# EAGLE design Poly_Piezo (EAGLE 9.6.2)
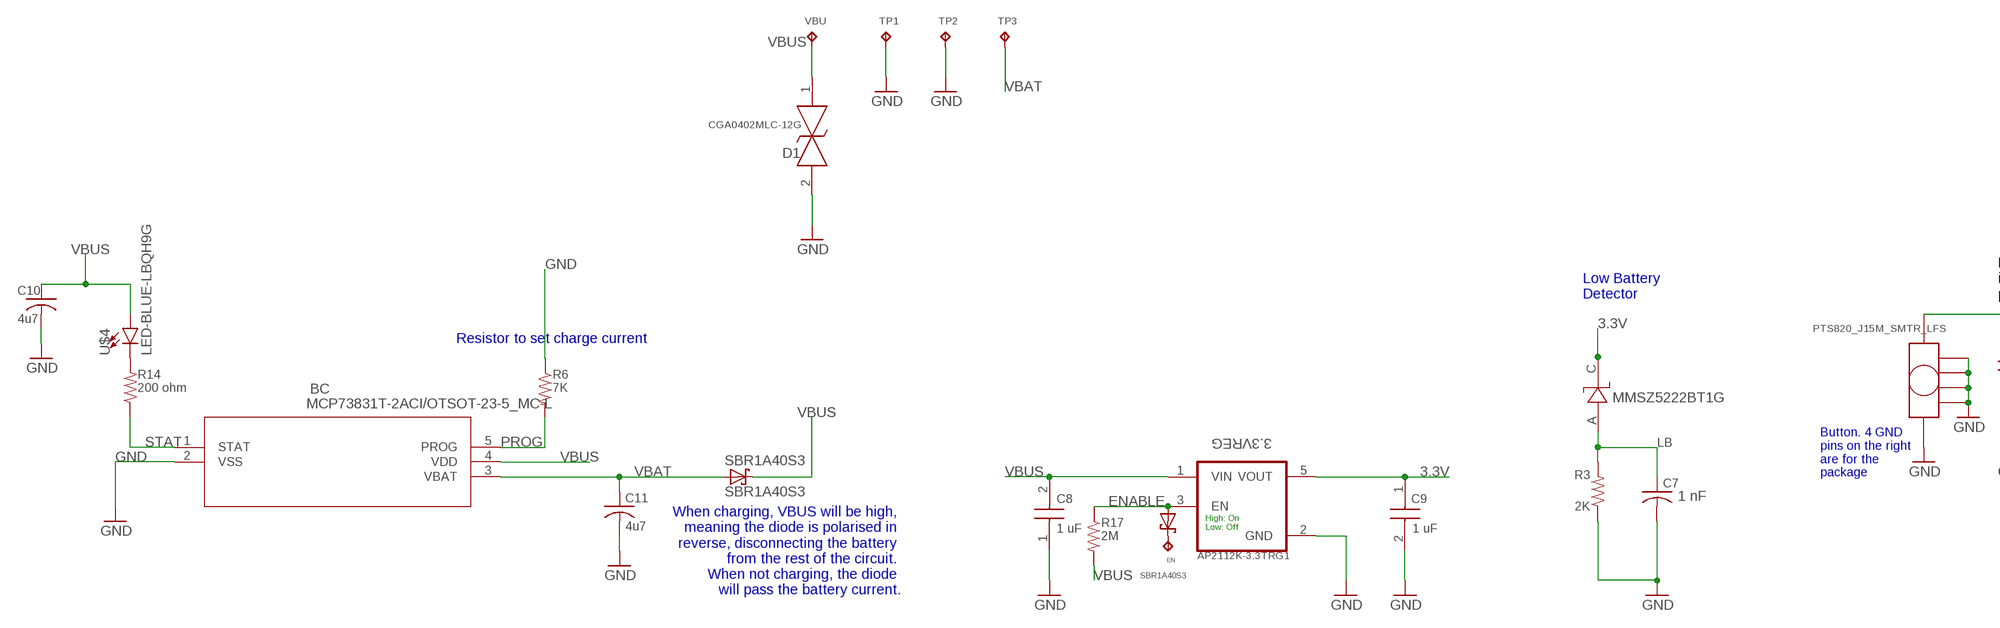
[diagram p0: schematic, sheet 1, part 1 of 2]
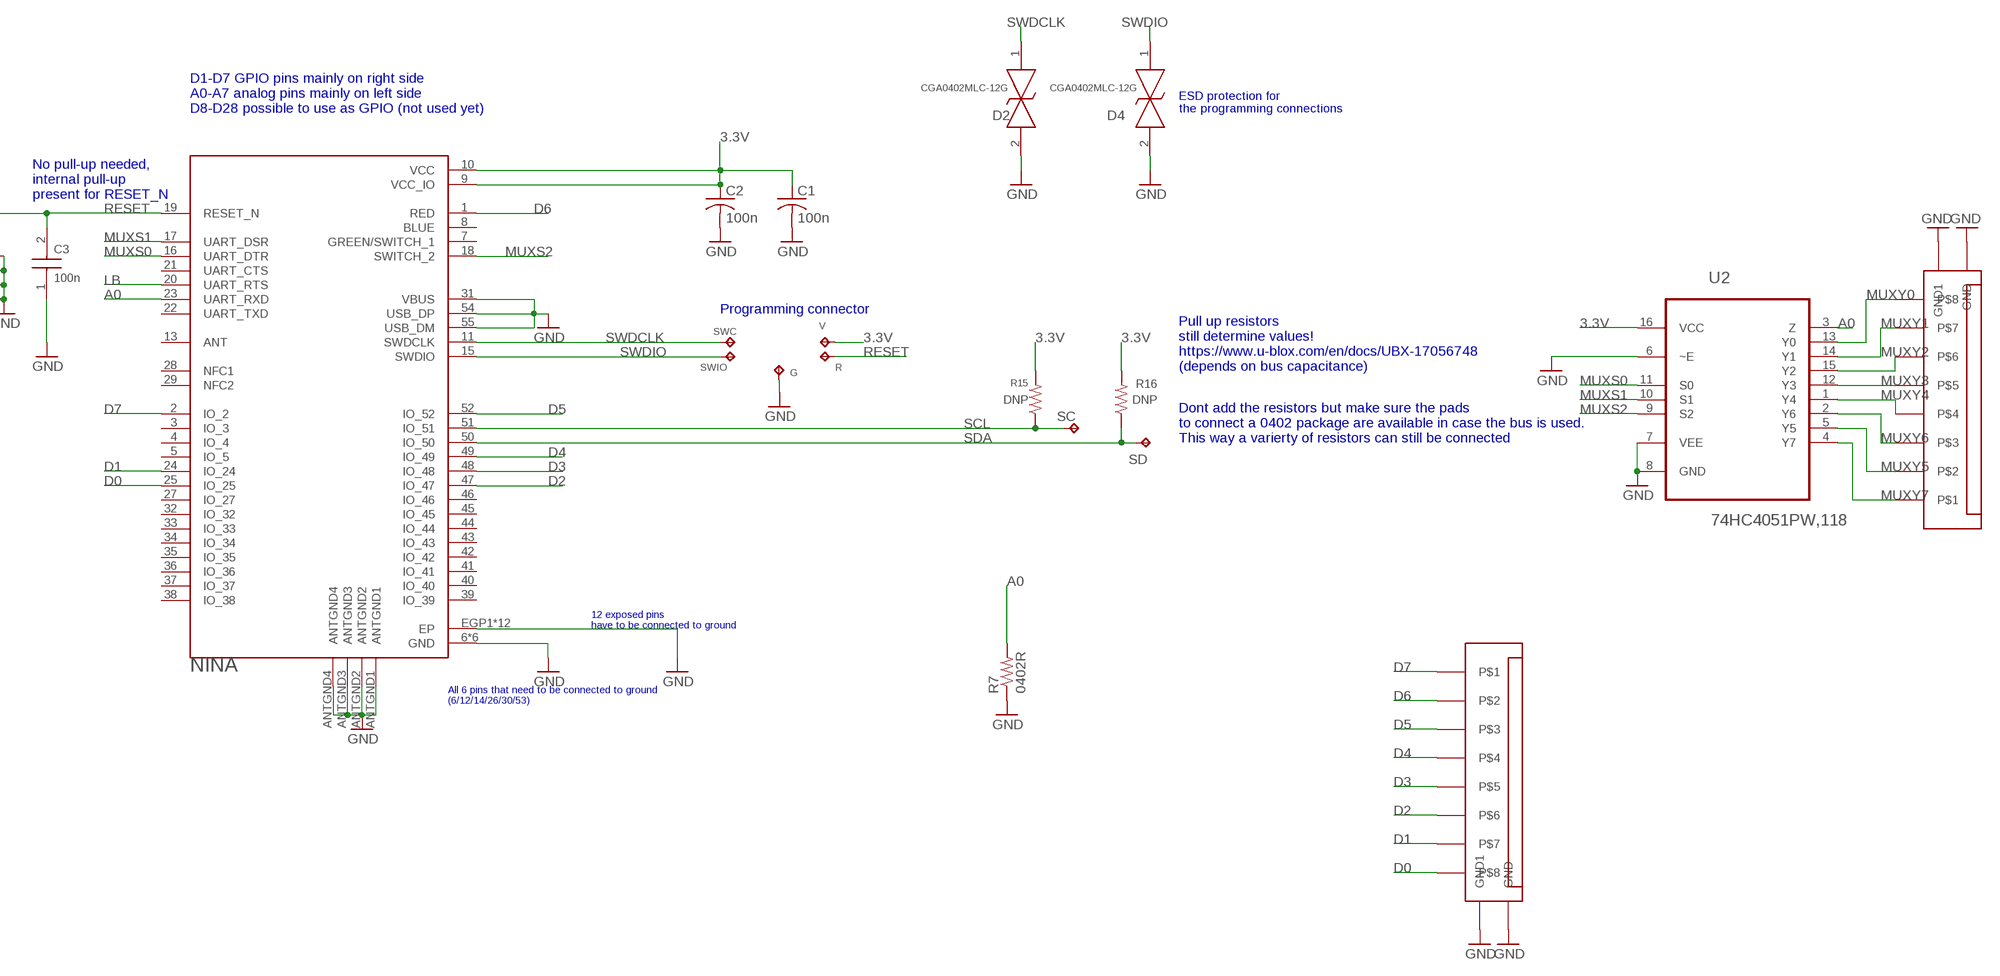
[diagram p1: schematic, sheet 1, part 2 of 2]

## Parts
3.3VREG  AP2112K-3.3TRG1  [SOT95P285X140-5N]
BC  MCP73831T-2ACI/OTSOT-23-5_MC-L  [SOT-23-5_MC-L]
BUTTON  PTS820_J15M_SMTR_LFS  [PTS820_J15]
C1  100n  C-USC0402  [C0402]
C2  100n  C-USC0402  [C0402]
C3  100n  JMK105BJ105KP-F  [CAPC1005X33N]
C7  1 nF  C-USC0402  [C0402]
C8  1 uF  JMK105BJ105KP-F  [CAPC1005X33N]
C9  1 uF  JMK105BJ105KP-F  [CAPC1005X33N]
C10  4u7  C-USC0402  [C0402]
C11  4u7  C-USC0402  [C0402]
D1  CGA0402MLC-12G  [CGA0402MLC12G]
D2  CGA0402MLC-12G  [CGA0402MLC12G]
D4  CGA0402MLC-12G  [CGA0402MLC12G]
EN  CUSTOM_HOLE1  [CUSTOM_HOLE]
G  TPB1,27  [B1,27]
MMSZ5222BT1G  MMSZ5222BT1G  [SOD−123]
R  TPB1,27  [B1,27]
R3  2K  0402R  [RESC1005X40N]
R6  7K  0402R  [RESC1005X40N]
R7  0402R  [RESC1005X40N]
R14  200 ohm  0402R  [RESC1005X40N]
R15  DNP  0402R  [RESC1005X40N]
R16  DNP  0402R  [RESC1005X40N]
R17  2M  0402R  [RESC1005X40N]
SBR1A40S3  SBR1A40S3  [SOD323]
SC  CUSTOM_HOLE1  [CUSTOM_HOLE]
SD  CUSTOM_HOLE1  [CUSTOM_HOLE]
SWC  TPB1,27  [B1,27]
SWIO  TPB1,27  [B1,27]
TP1  CUSTOM_HOLE1  [CUSTOM_HOLE]
TP2  CUSTOM_HOLE1  [CUSTOM_HOLE]
TP3  CUSTOM_HOLE1  [CUSTOM_HOLE]
U1  NINA  NINA-B306  [XCVR_NINA-B306]
U2  74HC4051PW,118  [SOP65P640X110-16N]
U$1  XF3M(1)-0815-1B  [XF3M(1)-0815-1B]
U$2  SBR1A40S3  [SOD323]
U$3  XF3M(1)-0815-1B  [XF3M(1)-0815-1B]
U$4  LED-BLUE-LBQH9G  [LBQH9G-0402]
V  TPB1,27  [B1,27]
VBU  CUSTOM_HOLE1  [CUSTOM_HOLE]

## Nets
3.3V: 3.3VREG.5(VOUT) C1.1 C2.1 C9.1 MMSZ5222BT1G.C R15.2 R16.2 U1.9(VCC_IO) U1.10(VCC) U2.16(VCC) V.TP
A0: R7.2 U1.23(UART_RXD) U2.3(Z)
D0: U1.25(IO_25) U$1.P$8
D1: U1.24(IO_24) U$1.P$7
D2: U1.47(IO_47) U$1.P$6
D3: U1.48(IO_48) U$1.P$5
D4: U1.49(IO_49) U$1.P$4
D5: U1.52(IO_52) U$1.P$3
D6: U1.1(RED) U$1.P$2
D7: U1.2(IO_2) U$1.P$1
ENABLE: 3.3VREG.3(EN) R17.1 U$2.A
GND: 3.3VREG.2(GND) BC.2(VSS) BUTTON.1 BUTTON.P$1 BUTTON.P$2 BUTTON.P$3 BUTTON.P$4 C1.2 C2.2 C3.1 C7.2 C8.1 C9.2 C10.2 C11.2 D1.2 D2.2 D4.2 G.TP R3.1 R6.1 R7.1 TP1.P$1(TP) TP2.P$1(TP) U1.6(GND) U1.12(GND) U1.14(GND) U1.26(GND) U1.30(GND) U1.31(VBUS) U1.53(GND) U1.54(USB_DP) U1.55(USB_DM) U1.ANTGND1 U1.ANTGND2 U1.ANTGND3 U1.ANTGND4 U1.EGP1(EP) U1.EGP2(EP) U1.EGP3(EP) U1.EGP4(EP) U1.EGP5(EP) U1.EGP6(EP) U1.EGP7(EP) U1.EGP8(EP) U1.EGP9(EP) U1.EGP10(EP) U1.EGP11(EP) U1.EGP12(EP) U2.6(~E) U2.7(VEE) U2.8(GND) U$1.P$9(GND1) U$1.P$10(GND) U$3.P$9(GND1) U$3.P$10(GND)
LB: C7.1 MMSZ5222BT1G.A R3.2 U1.20(UART_RTS)
MUXS0: U1.16(UART_DTR) U2.11(S0)
MUXS1: U1.17(UART_DSR) U2.10(S1)
MUXS2: U1.18(SWITCH_2) U2.9(S2)
MUXY0: U2.13(Y0) U$3.P$8
MUXY1: U2.14(Y1) U$3.P$7
MUXY2: U2.15(Y2) U$3.P$6
MUXY3: U2.12(Y3) U$3.P$5
MUXY4: U2.1(Y4) U$3.P$4
MUXY5: U2.5(Y5) U$3.P$2
MUXY6: U2.2(Y6) U$3.P$3
MUXY7: U2.4(Y7) U$3.P$1
N$1: R14.2 U$4.C
N$11: EN.P$1(TP) U$2.C
PROG: BC.5(PROG) R6.2
RESET: BUTTON.2 C3.2 R.TP U1.19(RESET_N)
SCL: R15.1 SC.P$1(TP) U1.51(IO_51)
SDA: R16.1 SD.P$1(TP) U1.50(IO_50)
STAT: BC.1(STAT) R14.1
SWDCLK: D2.1 SWC.TP U1.11(SWDCLK)
SWDIO: D4.1 SWIO.TP U1.15(SWDIO)
VBAT: BC.3(VBAT) C11.1 SBR1A40S3.A TP3.P$1(TP)
VBUS: 3.3VREG.1(VIN) BC.4(VDD) C8.2 C10.1 D1.1 R17.2 SBR1A40S3.C U$4.A VBU.P$1(TP)
Unconnected: U1.3(IO_3) U1.4(IO_4) U1.5(IO_5) U1.7(GREEN/SWITCH_1) U1.8(BLUE) U1.13(ANT) U1.21(UART_CTS) U1.22(UART_TXD) U1.27(IO_27) U1.28(NFC1) U1.29(NFC2) U1.32(IO_32) U1.33(IO_33) U1.34(IO_34) U1.35(IO_35) U1.36(IO_36) U1.37(IO_37) U1.38(IO_38) U1.39(IO_39) U1.40(IO_40) U1.41(IO_41) U1.42(IO_42) U1.43(IO_43) U1.44(IO_44) U1.45(IO_45) U1.46(IO_46)

## Notes on the sheet
- D1-D7 GPIO pins mainly on right side
  A0-A7 analog pins mainly on left side
  D8-D28 possible to use as GPIO (not used yet)
- ESD protection for 
  the programming connections
- Low Battery
  Detector
- No pull-up needed,
  internal pull-up
  present for RESET_N
- Resistor to set charge current
- Programming connector
- Button. 4 GND
  pins on the right
  are for the
  package
- Pull up resistors
  still determine values!
  https://www.u-blox.com/en/docs/UBX-17056748
  (depends on bus capacitance)
- When charging, VBUS will be high, 
  meaning the diode is polarised in 
  reverse, disconnecting the battery 
  from the rest of the circuit. 
  When not charging, the diode 
  will pass the battery current.
- High: On
  Low: Off
- Dont add the resistors but make sure the pads 
  to connect a 0402 package are available in case the bus is used. 
  This way a varierty of resistors can still be connected
- 12 exposed pins 
  have to be connected to ground
- All 6 pins that need to be connected to ground
  (6/12/14/26/30/53)

## Library data of the parts
3.3VREG = AP2112K-3.3TRG1:AP2112K-3.3TRG1: AP2112 Series 0.6 A 3.3 V Fixed Output SMT LDO Linear Regulator - SOT23-5; AVAILABILITY: Unavailable; DESCRIPTION: Linear Voltage Regulator IC 1 Output 600mA SOT-25; MF: Diodes Inc.; MP: AP2112K-3.3TRG1; PACKAGE: SOT-753 Diodes Inc.; PRICE: None
BC = MCP73831T-2ACI-OT_BattCharg:MCP73831T-2ACI/OT; BUILT_BY: EMA_UL_Team; MANUFACTURER_PART_NUMBER: MCP73831T-2ACI/OT; VENDOR: Microchip
BUTTON = [button]PTS820_J15M_SMTR_LFS:PTS820_J15M_SMTR_LFS: PTS 820 Series Microminiature SMT Top Actuated Source: Datasheet <http://www.ckswitches.com/media/1474/pts820.pdf>; DESCRIPTION: PTS 820 Series Microminiature SMT Top Actuated; HEIGHT: mm; MANUFACTURER_NAME: C & K COMPONENTS; MANUFACTURER_PART_NUMBER: PTS820 J15M SMTR LFS; MOUSER_PART_NUMBER: 611-PTS820J15MSMTR; MOUSER_PRICE-STOCK: https://www.mouser.com/Search/Refine.aspx?Keyword=611-PTS820J15MSMTR; RS_PART_NUMBER: 1359503P; RS_PRICE-STOCK: http://uk.rs-online.com/web/p/products/1359503P
C1 C2 C7 C10 C11 = rcl:C-US: CAPACITOR, American symbol; SPICEPREFIX: C
C3 C8 C9 = capacitor_1uF_0402:JMK105BJ105KP-F: Taiyo Yuden JMK105BJ105KP-F 1F MLCC 6.3V dc +/-10% Tolerance SMD Source: Datasheet <https://componentsearchengine.com/Datasheets/1/JMK105BJ105KP-F.pdf>; DESCRIPTION: Taiyo Yuden JMK105BJ105KP-F 1F MLCC 6.3V dc +/-10% Tolerance SMD; HEIGHT: 0.33mm; MANUFACTURER_NAME: TAIYO YUDEN; MANUFACTURER_PART_NUMBER: JMK105BJ105KP-F; MOUSER_PART_NUMBER: 963-JMK105BJ105KP-F; MOUSER_PRICE-STOCK: https://www.mouser.com/Search/Refine.aspx?Keyword=963-JMK105BJ105KP-F
D1 D2 D4 = CGA0402MLC-12G:CGA0402MLC-12G: Bourns CGA0402MLC-12G, ESD Protection Diode, 2-Pin MLC Source: Datasheet <https://componentsearchengine.com/Datasheets/1/CGA0402MLC-12G.pdf>; DESCRIPTION: Bourns CGA0402MLC-12G, ESD Protection Diode, 2-Pin MLC; HEIGHT: 0.44mm; MANUFACTURER_NAME: Bourns; MANUFACTURER_PART_NUMBER: CGA0402MLC-12G; MOUSER_PART_NUMBER: 652-CGA0402MLC-12G; MOUSER_PRICE-STOCK: https://www.mouser.com/Search/Refine.aspx?Keyword=652-CGA0402MLC-12G
EN SC SD TP1-TP3 VBU = testpad:CUSTOM_HOLE1
G R SWC SWIO V = testpad:TP: Test pad
MMSZ5222BT1G = [Zener]MMSZ52xxxT1G:MMSZ5222BT1G
R3 R6 R7 R14-R17 = custom0402R:0402R
SBR1A40S3 U$2 = diode:SBR1A40S3
U1 = NINA-B306:NINA-B306: BLUETOOTH LOW ENERGY MODULE STAN; AVAILABILITY: Unavailable; DESCRIPTION: Bluetooth Bluetooth v5.0 Transceiver Module 2.4GHz Antenna Not Included Surface Mount; MF: U-Blox America Inc.; MP: NINA-B311-00B; PACKAGE: SMD-55 U-Blox America Inc.; PRICE: None
U2 = 74HC4051PW_118:74HC4051PW,118: 8-channel analog multiplexer/demultiplexer Check availability <https://pricing.snapeda.com/parts/74HC4051PW%2C118/Nexperia%20USA%20Inc./view-part?ref=eda>; AVAILABILITY: In Stock; DESCRIPTION: 1 Circuit IC Switch 8:1 120Ohm 16-TSSOP; MF: Nexperia USA Inc.; MP: 74HC4051PW,118; PACKAGE: TSSOP-16 Texas Instruments; PRICE: None; PURCHASE-URL: https://pricing.snapeda.com/search/part/74HC4051PW,118/?ref=eda
U$1 U$3 = XF3M(1)-0815-1B:XF3M(1)-0815-1B
U$4 = SparkFun-LED:LED-BLUE-LBQH9G

## Board
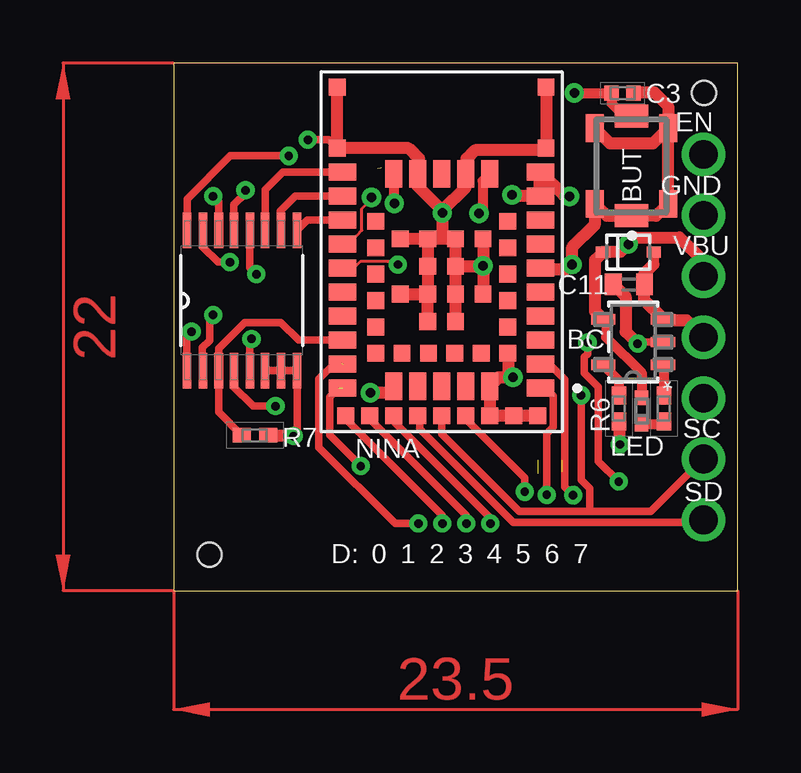
[diagram p2: board, top side]
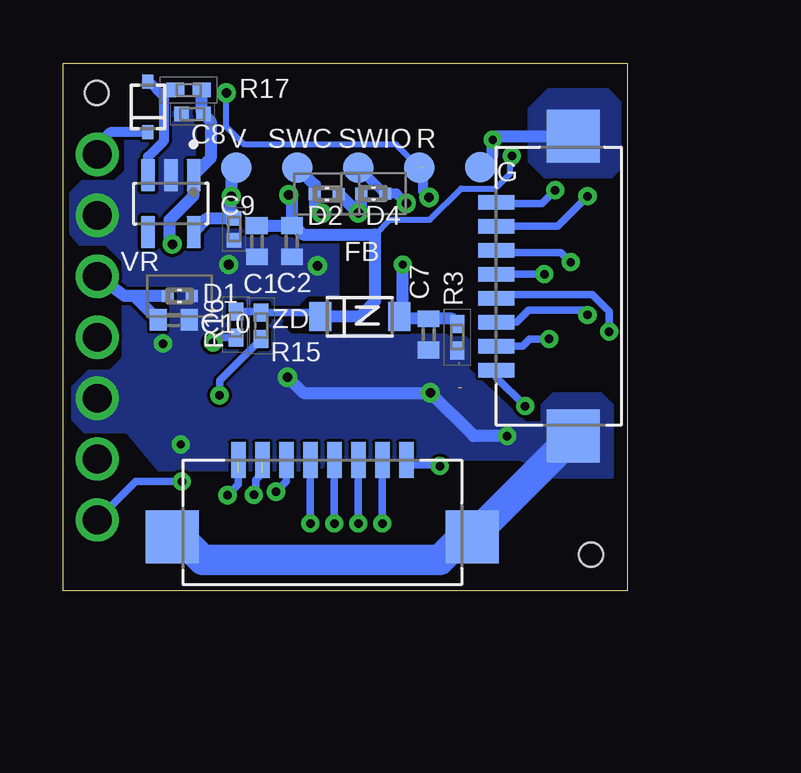
[diagram p3: board, bottom side, seen from below]

Size 23.5 x 22 mm. Coordinates in mm from the lower left corner, seen from the top.
Outline: 0,0 23.5,0 23.5,22 0,22 0,0
Copper layers (1*16): Top 0.035mm / dielectric 1.5mm / Bottom 0.035mm
Design rules "default *": minimum track width 3mil, minimum drill 0.35mm, track to track 5mil, track to pad 5mil, pad to pad 6mil, via to via 6mil, smd to smd 6mil, copper to edge 10mil, drill to drill 0.4mm, minimum pad ring 10mil, minimum via ring 8mil, stop-mask expansion 4mil, vias tented up to drill 0mil, thermal gap 0mil
Holes 1 mm at 22.1,20.75 1.5,1.5

### Footprints (pad centres in the part's own frame; a part is rotated, then mirrored left to right if it is on the bottom)
SOT95P285X140-5N = smd 1.35 x 0.6: 1 -1.185,0.95; 2 -1.185,0; 3 -1.185,-0.95; 4 1.185,-0.95; 5 1.185,0.95
SOT-23-5_MC-L = smd 1.01 x 0.428: 1 -1.245,0.95; 2 -1.245,0; 3 -1.245,-0.95; 4 1.245,-0.95; 5 1.245,0.95
PTS820_J15 = smd 0.95 x 1.4: 1 -2.075,0; 2 2.075,0 | smd 1.15 x 0.75: P$1 -1.575,1.525; P$2 1.575,1.525; P$3 1.575,-1.525; P$4 -1.575,-1.525
C0402 = smd 0.7 x 0.9: 1 -0.65,0; 2 0.65,0
CAPC1005X33N = smd 0.6 x 0.62: 1 -0.46,0; 2 0.46,0
CGA0402MLC12G = smd 0.5 x 0.5: 1 -0.5,0; 2 0.5,0
CUSTOM_HOLE = drill 1.2: P$1 0,0
B1,27 = smd 1.27 x 1.27: TP 0,0
SOD−123 = smd 0.91 x 1.22: A 3.28,0; C 0,0
RESC1005X40N = smd 0.75 x 0.6: 1 -0.55,0; 2 0.55,0
SOD323 = smd 0.59 x 0.45: A 2.405,0; C 0.295,0
XCVR_NINA-B306 = smd 1.15 x 0.7: 1 -4.125,4; 2 -4.125,3; 3 -4.125,2; 4 -4.125,1; 5 -4.125,0; 6 -4.125,-1; 7 -4.125,-2; 8 -4.125,-3; 9 -4.125,-4; 10 -4.125,-5; 16 4.125,-5; 17 4.125,-4; 18 4.125,-3; 19 4.125,-2; 20 4.125,-1; 21 4.125,0; 22 4.125,1; 23 4.125,2; 24 4.125,3; 25 4.125,4 | smd 0.7 x 1.15: 11 -2,-4.925; 12 -1,-4.925; 13 0,-4.925; 14 1,-4.925; 15 2,-4.925; 26 2,3.925; 27 1,3.925; 28 0,3.925; 29 -1,3.925; 30 -2,3.925 | smd 0.7 x 0.7: 31 -2.75,2.55; 32 -2.75,1.45; 33 -2.75,0.35; 34 -2.75,-0.75; 35 -2.75,-1.85; 36 -2.75,-2.95; 37 2.75,-2.95; 38 2.75,-1.85; 39 2.75,-0.75; 40 2.75,0.35; 41 2.75,1.45; 42 2.75,2.55; 43 1.65,2.55; 44 0.55,2.55; 45 -0.55,2.55; 46 -1.65,2.55; 47 4,5.15; 48 3,5.15; 49 2,5.15; 50 1,5.15; 51 0,5.15; 52 -1,5.15; 53 -2,5.15; 54 -3,5.15; 55 -4,5.15; ANTGND1 -4.35,-6; ANTGND2 -4.35,-8.55; ANTGND3 4.35,-6; ANTGND4 4.35,-8.55; EGP1 -0.575,1.225; EGP2 0.575,1.225; EGP3 -1.725,0.075; EGP4 -0.575,0.075; EGP5 0.575,0.075; EGP6 1.725,0.075; EGP7 -0.575,-1.075; EGP8 0.575,-1.075; EGP9 -1.725,-2.225; EGP10 -0.575,-2.225; EGP11 0.575,-2.225; EGP12 1.725,-2.225
SOP65P640X110-16N = smd 1.473 x 0.356: 1 -2.921,2.286; 2 -2.921,1.626; 3 -2.921,0.965; 4 -2.921,0.33; 5 -2.921,-0.33; 6 -2.921,-0.965; 7 -2.921,-1.626; 8 -2.921,-2.286; 9 2.921,-2.286; 10 2.921,-1.626; 11 2.921,-0.965; 12 2.921,-0.33; 13 2.921,0.33; 14 2.921,0.965; 15 2.921,1.626; 16 2.921,2.286
XF3M(1)-0815-1B = smd 0.6 x 1.5: P$1 -3.5,0; P$2 -2.5,0; P$3 -1.5,0; P$4 -0.5,0; P$5 0.5,0; P$6 1.5,0; P$7 2.5,0; P$8 3.5,0 | smd 2.2 x 2.2: P$9 -6.25,-3.2; P$10 6.25,-3.2
LBQH9G-0402 = smd 0.6 x 0.55: A 0.55,0; C -0.55,0

### Placement (x,y rotation side)
3.3VREG  19.01,16.14 270 bottom
BC  19.15,10.37 180 top
BUTTON  19.08,17.71 90 top
C1  15.42,14.57 270 bottom
C2  13.97,14.57 270 bottom
C3  18.71,20.75 180 top
C7  8.27,10.69 270 bottom
C8  18.11,19.88 0 bottom
C9  16.38,15.07 270 bottom
C10  18.89,11.29 0 bottom
C11  18.97,12.77 180 top
D1  18.65,12.29 0 bottom
D2  12.51,16.54 0 bottom
D4  10.57,16.56 180 bottom
EN  22.08,18.19 90 top
G  6.11,17.66 0 bottom
MMSZ5222BT1G  12.78,11.43 0 bottom
R  8.66,17.65 0 bottom
R3  7.08,10.57 90 bottom
R6  18.56,7.6 90 top
R7  3.39,6.48 180 top
R14  20.43,7.6 270 top
R15  15.25,11.05 90 bottom
R16  16.3,11.1 90 bottom
R17  18.27,20.88 0 bottom
SBR1A40S3  17.6,14.12 0 top
SC  22.08,5.49 270 top
SD  22.08,2.95 270 top
SWC  13.74,17.65 0 bottom
SWIO  11.2,17.65 0 bottom
TP1  22.08,15.65 0 bottom
TP2  22.08,8.03 0 top
TP3  22.08,10.57 0 top
U1  11.17,12.45 180 top
U2  2.85,12.1 90 top
U$1  12.7,5.45 0 bottom
U$2  19.97,18.82 90 bottom
U$3  5.45,12.7 90 bottom
U$4  19.5,7.5 90 top
V  16.29,17.65 0 bottom
VBU  22.08,13.11 180 top

### Tracks (layer width: path | path; a pad name or v marks a point on that pad's centre or on a via)
3.3V  (via drill 0.35, 0.4)
  Top 0.305: U2.16 0.57,16.33 2.37,18.13 v4.8,18.13
  Top 0.508: v16.5,16.45 16.3,16.45 15.35,17.39 15.39,17.39 15.45,17.45 U1.10 | U1.9 14.15,16.45 v14.1,16.5
  Top 0.61: U1.10 U1.9
  Bottom 0.254: 10.5,14.86 9.89,15.47 8.22,15.47 6.91,16.77 5.49,16.77 4.87,17.39 4.87,18.06 v4.8,18.13
  Bottom 0.305: R16.2 15.3,11.65 R15.2 12.95,11.6 MMSZ5222BT1G.C
  Bottom 0.508: C1.1 C2.1 | 3.3VREG.5 17.48,15.53 C9.1 16.53,15.68 16.53,16.41 v16.5,16.45 16.5,17.45 V.TP | v14.1,16.5 13.97,16.37 C2.1 | C2.1 13.87,15.22 13.51,14.86 10.5,14.86 10.5,13.5 10.5,12.07 11.14,11.43 MMSZ5222BT1G.C
A0
  Top 0.305: U1.23 5.21,10.45 4.48,11.18 2.97,11.18 1.89,10.1 U2.3 1.89,7.45 R7.2
D0  (via drill 0.35)  (1 unrouted)
  Top 0.305: 6.89,8.45 6.51,8.08 6.51,6.49 v7.8,5.2
  Bottom 0.305: v7.8,5.2 7.85,5.25 9,5.25 U$1.P$8
D1  (via drill 0.35)  (1 unrouted)
  Top 0.305: 6.99,9.51 6.74,9.51 6.06,8.82 6.06,5.98 9.23,2.8 v10.2,2.8
  Bottom 0.305: v10.2,2.8 U$1.P$7
D2  (via drill 0.35)
  Top 0.152: U1.47 7.2,7.27
  Top 0.305: 7.2,7.27 7.13,7.2 11.2,3.14 v11.2,2.8
  Bottom 0.305: U$1.P$6 v11.2,2.8
D3  (via drill 0.35)
  Top 0.305: U1.48 8.16,7.17 12.2,3.14 v12.2,2.8
  Bottom 0.305: U$1.P$5 v12.2,2.8
D4  (via drill 0.35)
  Top 0.305: U1.49 9.05,7.18 13.2,3.04 v13.2,2.8
  Bottom 0.305: U$1.P$4 v13.2,2.8
D5  (via drill 0.35)
  Top 0.305: U1.52 12.21,7.25 12.21,7.12 14.63,4.71 v14.63,4.13
  Bottom 0.305: v14.63,4.13 14.2,4.57 U$1.P$3
D6  (via drill 0.35)  (1 unrouted)
  Top 0.305: v15.55,4 15.55,6.55 15.82,6.82 15.82,8.12 15.49,8.45 U1.1
  Bottom 0.305: v15.55,4 15.47,4.08 15.47,4.62 15.2,4.88
D7  (via drill 0.35)  (1 unrouted)
  Top 0.305: U1.2 15.34,9.4 15.7,9.4 16.3,8.8 16.3,4.33 v16.65,3.98
  Bottom 0.305: v16.65,3.98 16.2,4.43 16.2,4.95
ENABLE
  Bottom 0.406: 3.3VREG.3 19.96,18.1 19.29,18.77 19.29,20.74 | U$2.A 19.92,21.23 19.36,20.67 19.29,20.74 | R17.1 19.15,20.88 19.29,20.74
GND  (via drill 0.35, 0.4)
  Top 0.15: U1.31
  Top 0.152: U1.EGP1 11.71,11.26 | U1.EGP5 10.6,12.35 10.57,12.38 | v12.89,13.54 v12.9,13.55 | U1.EGP7 11.77,13.54 | U1.26 8.89,8.25
  Top 0.254: 13.97,9.86 U1.31
  Top 0.305: U2.6 U2.7 U2.8 5.15,9.16 5.15,6.6 v5,6.45 | U1.ANTGND3 6.47,18.8 v5.6,18.8 | BC.2 19.41,10.37 v19.34,10.3
  Top 0.508: U1.EGP11 U1.EGP8 U1.EGP5 | U1.55 U1.54 U1.53 U1.30 13.54,8.9 v14.15,8.9 13.97,9.08 13.97,9.86 | U1.EGP1 U1.EGP4 U1.EGP7 U1.EGP10 11.2,14.68 | U1.EGP2 10.6,12.35 | 11.77,13.54 v12.89,13.54 | U1.EGP9 v12.9,13.55 U1.EGP3 | U1.ANTGND2 U1.ANTGND1 15.43,18.36 12.55,18.36 12.21,18.02 12.21,17.42 U1.12 12.17,16.82 11.2,15.85 | U1.EGP12 U1.EGP11 | U1.EGP6 10.57,12.38 | U1.ANTGND4 U1.ANTGND3 9.79,18.45 10.23,18.02 10.23,17.43 U1.14 10.17,16.88 10.21,16.83 11.2,15.85 | 8.89,8.25 v8.2,8.25 | U1.6 15.35,13.39 16.34,13.39 16.55,13.6 v16.6,13.6 16.6,14.3 17.54,15.24 17.54,16.12 BUTTON.P$1 18.05,15.63 BUTTON.1 20.11,15.63 BUTTON.P$4 BUTTON.P$3 | U1.EGP11 11.2,14.68 | 11.2,15.85 v11.2,15.75 11.2,14.68 | C11.2 18.34,12.77 18.84,12.28 18.84,10.8 v19.34,10.3 | BUTTON.P$2 18.19,18.65 19.97,18.65 BUTTON.P$3 | v18.6,6.1 18.6,7.05 R6.1 | C3.1 19.19,20.77 20.05,20.77 20.61,20.21 BUTTON.P$3 | R7.1 4.97,6.48 v5,6.45
  Bottom 0.508: v14.15,8.9 13.5,8.25 v8.2,8.25 6.4,6.45 v5,6.45 | D4.2 11.07,15.88 v11.2,15.75 11.99,16.54 D2.2 | U$3.P$10 5.45,18.95 v5.6,18.8 5.6,18.17 G.TP
  Bottom 1.27: U$3.P$9 U$1.P$10 6.85,2.25 7.82,1.28 17.68,1.28 18.65,2.25 U$1.P$9
  pour Bottom: 18.06,17.21 16,15.15 12.05,15.15 12.05,12.35 13.3,12.35 14.5,11.15 14,10.65 6.85,10.65 6.65,10.45 6.65,9.25 4.25,7 2.95,7 2.8,6.85 2.8,6.05 3.7,5.15 3.85,5.15 4,5.3 4.5,5.5 12.35,5.5 12.8,5.05 19.54,5.05 20.84,6.65 22.62,6.65 23.1,7.13 23.1,8.5 22.45,9.15 21.55,9.15 21,9.7 21,13.75 21.7,14.45 22.8,14.45 23.3,15.05 23.3,16.45 22.7,17.05 21.35,17.05 20.9,17.5 20.9,20.05 17.99,20.05
  pour Bottom: 0.7,17.35 3.4,17.35 4,17.95 4,20.05 3.25,20.8 0.85,20.8 0.3,20.25 0.3,17.75
  pour Bottom: 0.6,4.8 0.6,7.75 1.05,8.2 3.1,8.2 3.55,7.75 3.55,5.25 3.1,4.8 3.05,4.75 0.6,4.75
LB  (via drill 0.35)
  Top 0.127: U1.20 7.5,13.45 7.79,13.74 9.2,13.74 v9.34,13.6 v9.35,13.6
  Bottom 0.127: 9.38,11.22 9.5,11.35 | 9.35,11.58 9.41,11.52 MMSZ5222BT1G.A 9.62,11.31
  Bottom 0.152: 9.5,11.35 MMSZ5222BT1G.A
  Bottom 0.508: MMSZ5222BT1G.A 9.35,11.58 v9.35,13.6 | R3.2 7.3,11.34 C7.1 9.26,11.34 9.38,11.22
MUXS0
  Top 0.305: U2.11 3.81,16.72 4.54,17.45 U1.16
MUXS1
  Top 0.305: U2.10 4.45,15.04 4.45,15.83 5.07,16.45 U1.17
MUXS2
  Top 0.305: U1.18 5.57,15.45 U2.9
MUXY0  (via drill 0.35)
  Top 0.305: v3,16.7 3,16.59 2.52,16.11 U2.13
  Bottom 0.305: v3,16.7 3.55,16.15 5.4,16.15 U$3.P$8
MUXY1  (via drill 0.35)
  Top 0.305: U2.14 1.89,16.21 v1.65,16.45
  Bottom 0.305: v1.65,16.45 2.9,15.2 U$3.P$7
MUXY2  (via drill 0.35)
  Top 0.305: U2.15 1.2,15 1.2,14.36 1.86,13.7 v2.35,13.7
  Bottom 0.305: v2.35,13.7 2.37,13.7 2.77,14.11 5.36,14.11 U$3.P$6
MUXY3  (via drill 0.35)
  Top 0.305: U2.12 3.18,13.47 v3.45,13.2
  Bottom 0.305: v3.45,13.2 U$3.P$5
MUXY4  (via drill 0.35)
  Top 0.305: U2.1 0.54,9.2 0.54,9.84 0.55,9.85 0.55,10.6 v0.75,10.8
  Bottom 0.305: v0.75,10.8 0.75,11.65 1.45,12.35 5.3,12.35 U$3.P$4
MUXY5  (via drill 0.35)
  Top 0.305: U2.5 3.18,10.43 v3.25,10.5
  Bottom 0.305: U$3.P$2 4.35,10.2 4.05,10.5 v3.25,10.5
MUXY6  (via drill 0.35)
  Top 0.305: U2.2 1.2,9.2 1.2,10.14 1.5,10.44 1.5,11.35 v1.65,11.5
  Bottom 0.305: v1.65,11.5 1.85,11.7 4.1,11.7 4.6,11.2 U$3.P$3
MUXY7  (via drill 0.35)
  Top 0.305: U2.4 2.5,9.16 2.5,8.52 3.31,7.7 v4.25,7.7
  Bottom 0.305: v4.25,7.7 5.45,8.9 U$3.P$1
N$1
  Top 0.406: U$4.C 20.48,6.95 20.43,7 R14.2
N$11
  Bottom 0.406: U$2.C 21.55,19.11 22,18.67 EN.P$1
PROG
  Top 0.406: BC.5 18.56,8.77 R6.2
RESET  (via drill 0.4)  (1 unrouted)
  Top 0.127: U1.19 7.08,14.48 7.33,14.48 7.84,15.03 7.84,15.94 8.25,16.33 v8.25,16.4
  Top 0.406: v16.7,20.75 C3.2 18.25,20.32 18.78,19.79 BUTTON.2
  Bottom 0.254: R.TP 9.61,18.6 15.95,18.6 16.7,19.35 v16.7,20.75
  Bottom 0.406: 8.51,17.61 8.51,16.66 v8.25,16.4
SCL  (via drill 0.35)
  Top 0.305: U1.51 11.17,6.53 14.4,3.3 17.45,3.3 | SC.P$1 19.89,3.3 17.45,3.3 | v16.98,8.15 16.98,4.62 17.33,4.27 17.33,3.42 17.45,3.3
  Bottom 0.305: R15.1 16.98,8.77 v16.98,8.15
SDA  (via drill 0.35)
  Top 0.305: SD.P$1 21.97,2.84 14.16,2.84 10.27,6.74 10.27,7.21 U1.50 | v17.25,10.35 17.25,9.88 17.12,9.75 17.12,9.08 17.7,8.5 17.7,5.4 v18.55,4.55
  Bottom 0.305: R16.1 17.05,10.55 v17.25,10.35 | v18.55,4.55 20.48,4.55 SD.P$1
STAT
  Top 0.152: BC.1 20.43,9.38
  Top 0.406: 20.43,9.38 R14.1
SWDCLK  (via drill 0.4)
  Top 0.406: U1.11 12.88,17.09 12.88,15.88 v12.73,15.73
  Bottom 0.508: v12.73,15.73 13.01,16.01 D2.1 13.01,16.92 SWC.TP
SWDIO  (via drill 0.4)
  Top 0.406: v9.2,16.15 9.2,17.34 U1.15
  Bottom 0.406: v9.2,16.15 9.61,16.56 D4.1 10.1,16.56 10.68,17.14 10.69,17.14 SWIO.TP
VBAT
  Top 0.406: SBR1A40S3.A 20,13.61
  Top 0.508: 20,13.61 19.62,13.22 C11.1 19.62,12.1 BC.3 20.45,11.32 20.5,11.27 21.38,11.27 TP3.P$1
VBUS  (via drill 0.4)
  Top 0.406: BC.4 18.03,11.19 18.03,10.56 19.5,9.09 U$4.A
  Top 0.508: BC.4 17.56,11.66 17.56,13.79 SBR1A40S3.C 18.62,14.12 v18.95,14.45 v18.95,14.46 19.22,14.73 21.09,14.73 22,13.82 VBU.P$1
  Bottom 0.508: v18.95,14.45 19.07,14.57 19.07,15.47 18.06,16.48 3.3VREG.1 17.35,18.04 17.35,19.58 C8.2 17.72,19.95 R17.2 | D1.1 20.54,12.29 | VBU.P$1 20.94,12.29 20.54,12.29 | C10.1 20.54,12.29
(copper drawn outside any net)
  shapes: Top area x2

### Text on the board
tPlace: D: | 0 | 1 | 2 | 3 | 4 | 5 | 6 | 7
bNames: FB | VR | ZD | C10